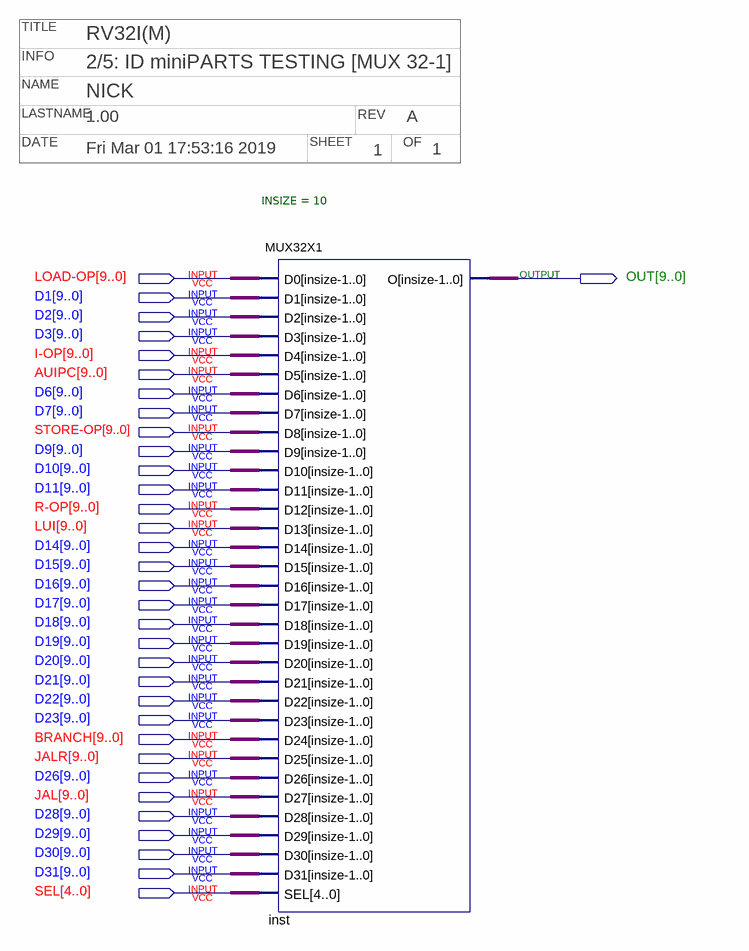
[diagram p0: schematic sheet]
// Quartus schematic MUX32X1TEST.bdf as structural Verilog: 1 symbols, 34 pins
// Title block: TITLE: RV32I(M); INFO: 2/5: ID miniPARTS TESTING [MUX 32-1]; NAME: NICK; LASTNAME: 1.00; REV: A; DATE: Fri Mar 01 17:53:16 2019; SHEET: 1; OF: 1
module MUX32X1TEST (
  input  [9:0] \LOAD-OP ,
  input  [9:0] D1,
  input  [9:0] D2,
  input  [9:0] D3,
  input  [9:0] \I-OP ,
  input  [9:0] AUIPC,
  input  [9:0] D6,
  input  [9:0] D7,
  input  [9:0] \STORE-OP ,
  input  [9:0] D9,
  input  [9:0] D10,
  input  [9:0] D11,
  input  [9:0] \R-OP ,
  input  [9:0] LUI,
  input  [9:0] D14,
  input  [9:0] D15,
  input  [9:0] D16,
  input  [9:0] D17,
  input  [9:0] D18,
  input  [9:0] D19,
  input  [9:0] D20,
  input  [9:0] D21,
  input  [9:0] D22,
  input  [9:0] D23,
  input  [9:0] BRANCH,
  input  [9:0] JALR,
  input  [9:0] D26,
  input  [9:0] JAL,
  input  [9:0] D28,
  input  [9:0] D29,
  input  [9:0] D30,
  input  [9:0] D31,
  input  [4:0] SEL,
  output [9:0] OUT
);

  MUX32X1 #(.INSIZE(10)) inst (
    .D0(\LOAD-OP ), .D1(D1), .D2(D2), .D3(D3), .D4(\I-OP ), .D5(AUIPC), .D6(D6), .D7(D7), .D8(\STORE-OP ),
    .D9(D9), .D10(D10), .D11(D11), .D12(\R-OP ), .D13(LUI), .D14(D14), .D15(D15), .D16(D16), .D17(D17),
    .D18(D18), .D19(D19), .D20(D20), .D21(D21), .D22(D22), .D23(D23), .D24(BRANCH), .D25(JALR), .D26(D26),
    .D27(JAL), .D28(D28), .D29(D29), .D30(D30), .D31(D31), .SEL(SEL), .O(OUT));
endmodule
